# EAGLE schematic elektrosluch diy schematic (EAGLE 7.3.0)
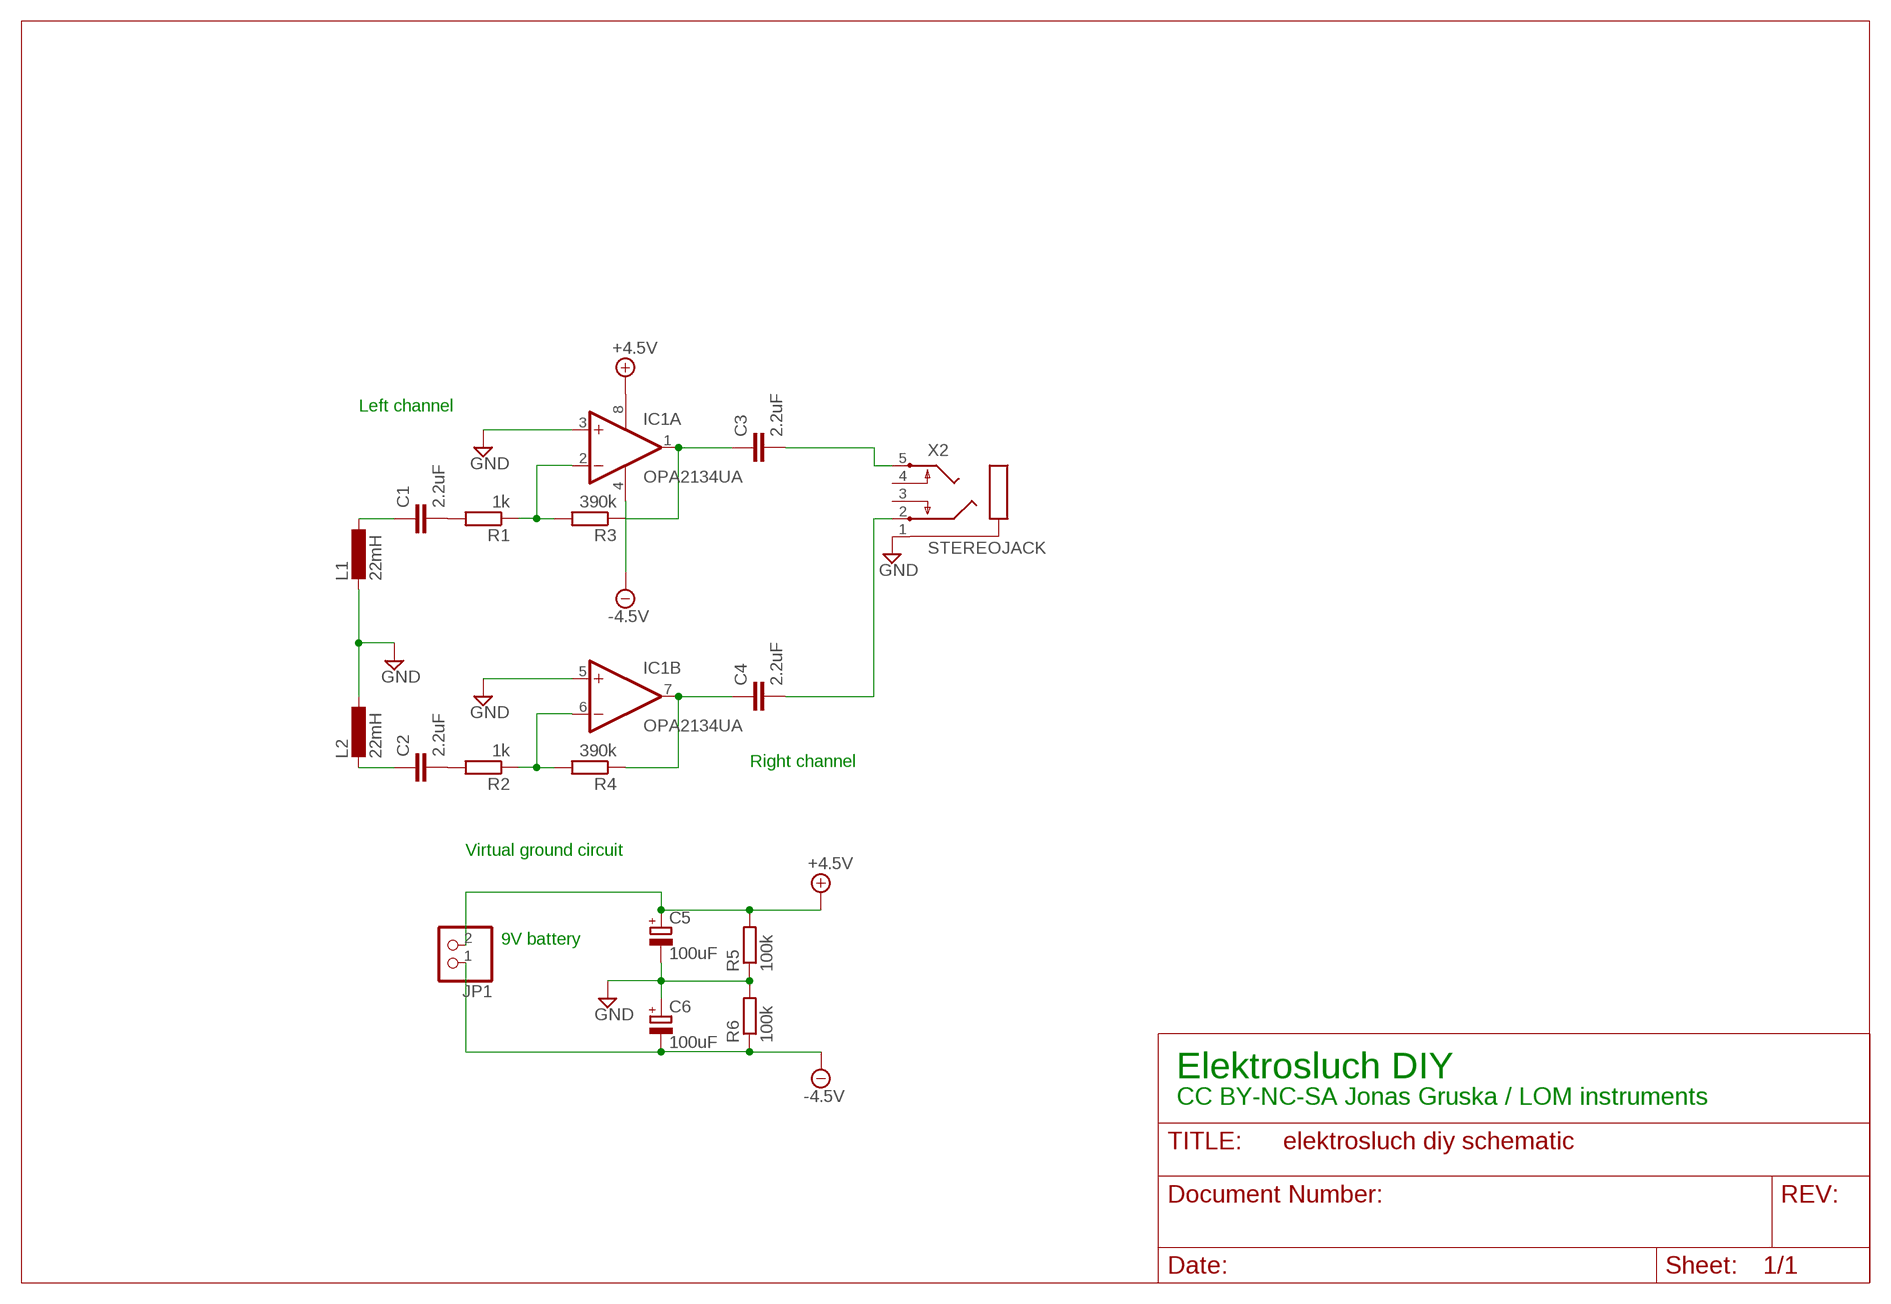
[diagram p0: schematic, sheet 1]

## Parts
C1  2.2uF  WIMA10UF  [WIMA10UF]
C2  2.2uF  WIMA10UF  [WIMA10UF]
C3  2.2uF  WIMA10UF  [WIMA10UF]
C4  2.2uF  WIMA10UF  [WIMA10UF]
C5  100uF  CPOL-EUD  [PANASONIC_D]
C6  100uF  CPOL-EUD  [PANASONIC_D]
IC1  OPA2134UA  [SO08]
JP1  PINHD-1X2  [1X02]
L1  22mH  COIL  [COIL]
L2  22mH  COIL  [COIL]
R1  1k  R-EU_R0805  [R0805]
R2  1k  R-EU_R0805  [R0805]
R3  390k  R-EU_R0805  [R0805]
R4  390k  R-EU_R0805  [R0805]
R5  100k  R-EU_R0805  [R0805]
R6  100k  R-EU_R0805  [R0805]
X2  STEREOJACK  [STX3100]

## Nets
+5V: C5.+ IC1.8(A:V+) JP1.2 R5.2 ; supply symbol labelled +4.5V
-5V: C6.- IC1.4(A:V-) JP1.1 R6.1 ; supply symbol labelled -4.5V
GND: C5.- C6.+ IC1.3(A:+IN) IC1.5(B:+IN) L1.P$2 L2.P$1 R5.1 R6.2 X2.1
N$1: IC1.2(A:-IN) R1.1 R3.2
N$2: C3.P$1 IC1.1(A:OUT) R3.1
N$3: C3.P$2
N$4: IC1.6(B:-IN) R2.1 R4.2
N$5: C4.P$1 IC1.7(B:OUT) R4.1
N$6: C4.P$2
N$7: X2.5
N$8: C1.P$1 L1.P$1
N$9: X2.2
N$10: C2.P$1 L2.P$2
N$11: C1.P$2 R1.2
N$15: C2.P$2 R2.2
Unconnected: X2.3 X2.4

## Notes on the sheet
- Left channel
- Right channel
- Virtual ground circuit
- 9V battery
- Elektrosluch DIY
- CC BY-NC-SA Jonas Gruska / LOM instruments

## Library data of the parts
C1-C4 = mojakniznica:WIMA10UF
C5 C6 = rcl:CPOL-EU: POLARIZED CAPACITOR, European symbol
IC1 = linear:OPA2*: Dual Operational Amplifier Low Power, Single-Supply, Rail-To-Rail Operational Amplifier Source: http://focus.ti.com/lit/ds/symlink/opa2345.pdf http://focus.ti.com .. opa241.pdf http://focus.ti.com/lit/ds/symlink/opa2134.pdf
JP1 = pinhead:PINHD-1X2: PIN HEADER
L1 L2 = mojakniznica:COIL
R1-R6 = rcl:R-EU_: RESISTOR, European symbol
X2 = adafruit:STEREOJACK: MIC/HEADPHONE JACK Stereo jack with two switches. Kycon STX3100, CUI SJ1-3555NG and/or 4UCon 05544